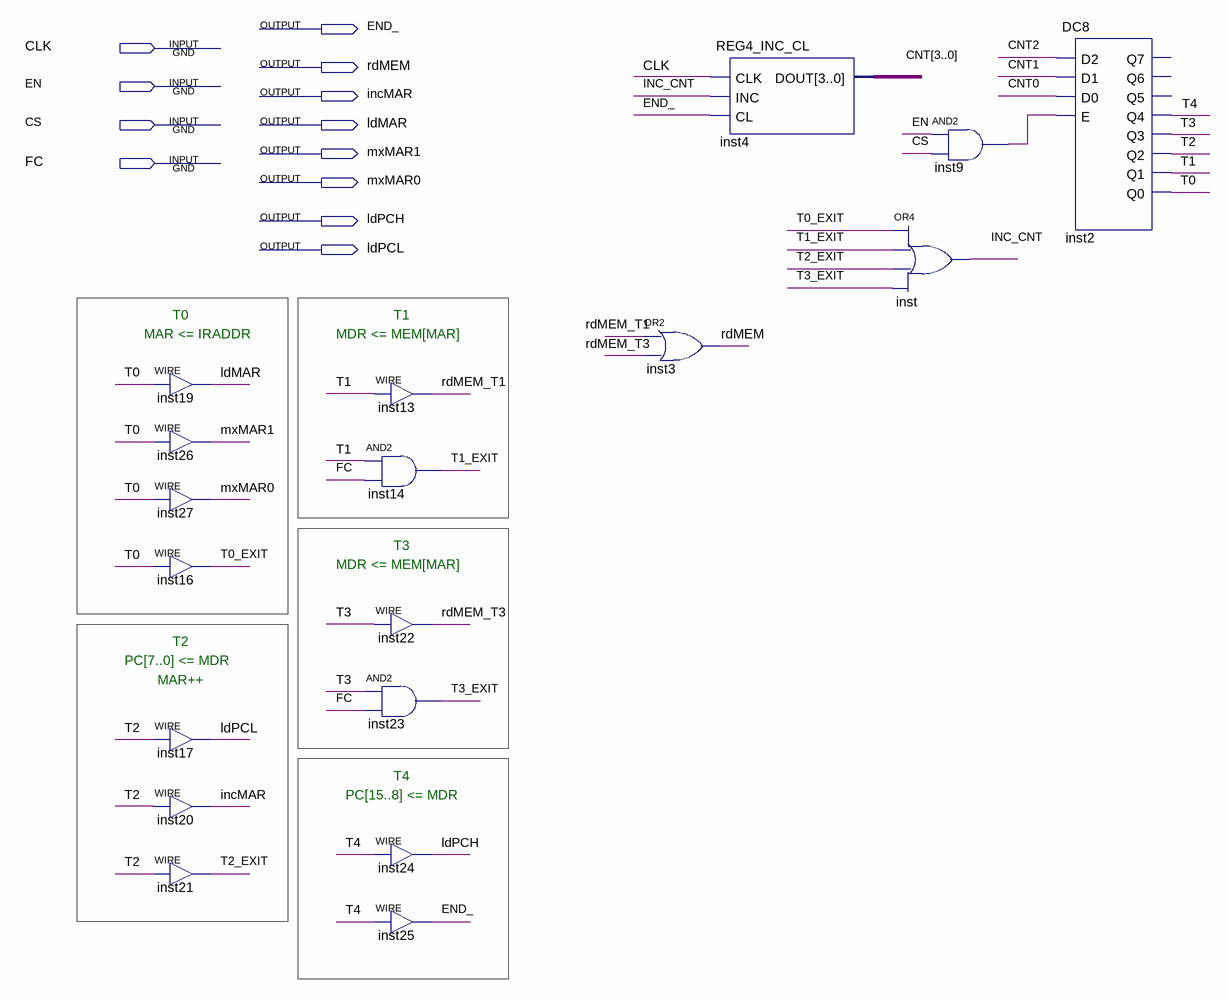
[diagram p0: schematic sheet]
// Quartus schematic JPI.bdf as structural Verilog: 18 symbols, 12 pins
module JPI (
  input  CLK,
  input  EN,
  input  CS,
  input  FC,
  output END_,
  output rdMEM,
  output incMAR,
  output ldMAR,
  output mxMAR1,
  output mxMAR0,
  output ldPCH,
  output ldPCL
);

  wire INC_CNT, inst9_out, rdMEM_T1, rdMEM_T3, T0, T0_EXIT, T1, T1_EXIT, T2, T2_EXIT, T3, T3_EXIT, T4;
  wire [3:0] CNT;

  assign ldMAR = T0;  // WIRE inst19
  assign mxMAR1 = T0;  // WIRE inst26
  assign mxMAR0 = T0;  // WIRE inst27
  assign T0_EXIT = T0;  // WIRE inst16
  assign ldPCL = T2;  // WIRE inst17
  assign incMAR = T2;  // WIRE inst20
  assign T2_EXIT = T2;  // WIRE inst21
  and inst14 (T1_EXIT, T1, FC);
  and inst23 (T3_EXIT, T3, FC);
  assign rdMEM_T1 = T1;  // WIRE inst13
  assign rdMEM_T3 = T3;  // WIRE inst22
  assign ldPCH = T4;  // WIRE inst24
  assign END_ = T4;  // WIRE inst25
  or inst3 (rdMEM, rdMEM_T1, rdMEM_T3);
  REG4_INC_CL inst4 (.CLK(CLK), .INC(INC_CNT), .CL(END_), .DOUT(CNT));
  or inst (INC_CNT, T0_EXIT, T1_EXIT, T2_EXIT, T3_EXIT);
  and inst9 (inst9_out, EN, CS);
  DC8 inst2 (
    .D2(CNT[2]), .D1(CNT[1]), .D0(CNT[0]), .E(inst9_out), .Q4(T4), .Q3(T3), .Q2(T2), .Q1(T1), .Q0(T0));  // open: Q7, Q6, Q5

  // Notes on the sheet:
  //   T0
  //   T1
  //   MAR <= IRADDR
  //   MDR <= MEM[MAR] 
  //   T3
  //   MDR <= MEM[MAR] 
  //   T2
  //   PC[7..0] <= MDR
  //    MAR++
  //   T4
  //   PC[15..8] <= MDR
endmodule
